# Altium project EEE3061WDesignProject_ControllerBoardV2.PrjPcb
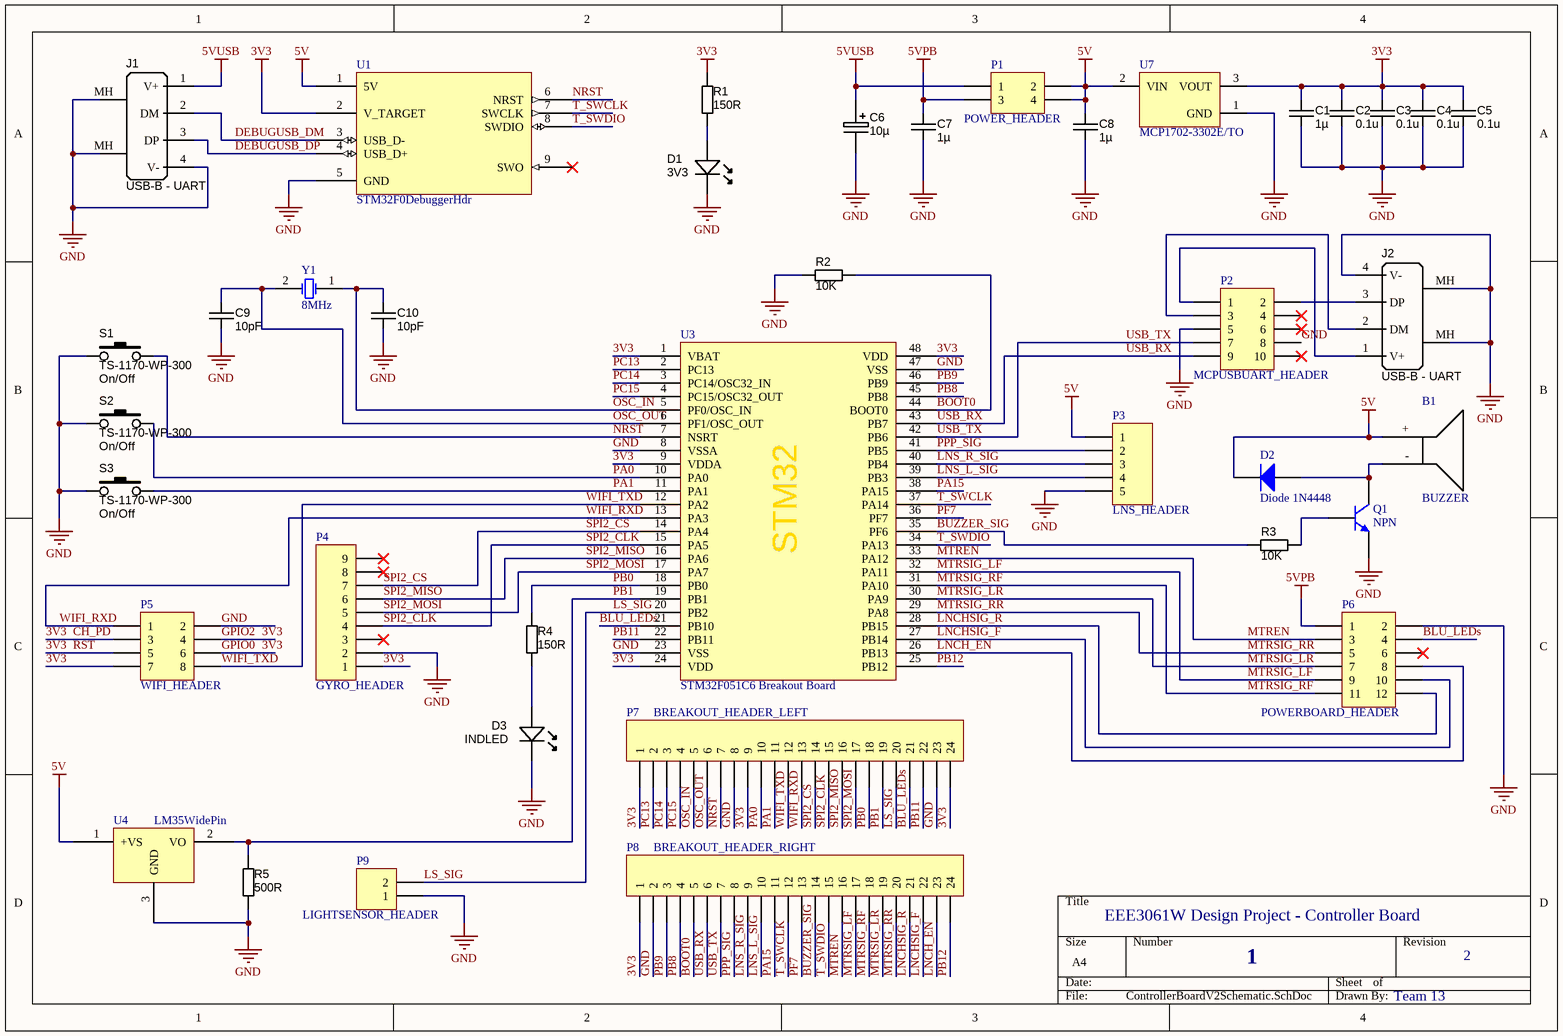
[diagram p0: ControllerBoardV2Schematic.SchDoc]
1 sheet, 39 parts. Net scope: global (net labels, ports and power ports of the same name join across sheets).
Board file: ControllerBoardV2PCB.PcbDoc

## Sheet ControllerBoardV2Schematic.SchDoc: EEE3061W Design Project - Controller Board
size A4; DrawnBy: Team 13; DocumentNumber: 1; Revision: 2; DocumentName: ControllerBoardSchematic

### Parts
B1  BUZZER  [HCM1206UX-G]
C1  value 1µ  [CAPC3216X180N]  (hidden comment: approved sub OK)
C2  value 0.1u  [CAPC2012X135N]  (hidden comment: approved sub OK)
C3  value 0.1u  [CAPC2012X135N]  (hidden comment: approved sub OK)
C4  value 0.1u  [CAPC2012X135N]  (hidden comment: approved sub OK)
C5  value 0.1u  [CAPC2012X135N]  (hidden comment: approved sub OK)
C6  10µ  [CAPR5-4X5]
C7  value 1µ  [CAPC3216X180N]  (hidden comment: approved sub OK)
C8  value 1µ  [CAPC3216X180N]  (hidden comment: approved sub OK)
C9  value 10pF  [CAPC2012X135N]  (hidden comment: approved sub OK)
C10  value 10pF  [CAPC2012X135N]  (hidden comment: approved sub OK)
D1  Color: 3V3  [LED-0805-K]  (hidden comment: 3V3LED)
D2  Diode 1N4448  [DO-35]
D3  INDLED  [LED-0805-K]
J1  USB-B - UART  [USB_TypeB_Tyco]
J2  USB-B - UART  [USB_TypeB_Tyco]
P1  POWER_HEADER  [HDR2X2]
P2  MCPUSBUART_HEADER  [HDR2X5]
P3  LNS_HEADER  [HDR1X5]
P4  GYRO_HEADER  [HDR1X9]
P5  WIFI_HEADER  [HDR2X4]
P6  POWERBOARD_HEADER  [HDR2X6]
P7  BREAKOUT_HEADER_LEFT  [HDR1X24]
P8  BREAKOUT_HEADER_RIGHT  [HDR1X24]
P9  LIGHTSENSOR_HEADER  [HDR1X2]
Q1  NPN  [TO-226-AA]
R1  value 150R  [RESC2012X70N]  (hidden comment: Thick Film)
R2  value 10K  [RESC2012X70N]  (hidden comment: Thick Film)
R3  value 10K  [RESC2012X70N]  (hidden comment: Thick Film)
R4  value 150R  [RESC2012X70N]  (hidden comment: Thick Film)
R5  value 500R  [RESC2012X70N]  (hidden comment: Thick Film)
S1  Manufacturer Part Number 1: TS-1170-WP-300  Function: On/Off  [TACT-SWITCH-TS1170]  (hidden comment: SW_THT_PB_7.0mm)
S2  Manufacturer Part Number 1: TS-1170-WP-300  Function: On/Off  [TACT-SWITCH-TS1170]  (hidden comment: SW_THT_PB_7.0mm)
S3  Manufacturer Part Number 1: TS-1170-WP-300  Function: On/Off  [TACT-SWITCH-TS1170]  (hidden comment: SW_THT_PB_7.0mm)
U1  STM32F0DebuggerHdr  [STM32F051C6_DbgrHdr]
U3  STM32F051C6 Breakout Board  [STM32F051C6BreakoutBoard]
U4  LM35WidePin  [TO-92Wide]
U7  MCP1702-3302E/TO  [TO-92-TO3]
Y1  8MHz  [8MHZOSC]

### Nets
3V3: C1.1 C2.1 C3.1 C4.1 C5.1 P4.1 P5.3 P5.4 P5.5 P5.6 P5.7 P7.1 P7.9 P7.24 P8.1 R1.1 U1.2(V_TARGET) U3.1(VBAT) U3.9(VDDA) U3.24(VDD) U3.48(VDD) U7.3(VOUT)  [also labelled CH_PD, GPIO0, GPIO2, RST]
5V: B1.+ C8.1 D2.2(K) P1.2 P1.4 P3.1 U1.1(5V) U4.1(+VS) U7.2(VIN)
5VPB: C7.1 P1.3 P6.1
5VUSB: C6.1 J1.1(V+) P1.1
GND: C1.2 C2.2 C3.2 C4.2 C5.2 C6.2 C7.2 C8.2 C9.2 C10.2 D1.K D3.K J1.4(V-) J1.MH(Shell) J2.4(V-) J2.MH(Shell) P2.5 P2.8 P3.5 P4.2 P5.2 P6.2 P7.8 P7.23 P8.2 P9.1 Q1.3(E) R2.1 R5.2 S1.1 S2.1 S3.1 U1.5(GND) U3.8(VSSA) U3.23(VSS) U3.47(VSS) U4.3(GND) U7.1(GND)
BLU_LEDs: P6.4 P7.21 U3.21(PB10)
BOOT0: P8.5 R2.2 U3.44(BOOT0)
BUZZER_SIG: P8.14 R3.1 U3.35(PF6)
DEBUGUSB_DM: J1.2(DM) U1.3(USB_D-)
DEBUGUSB_DP: J1.3(DP) U1.4(USB_D+)
LNCH_EN: P6.8 P8.23 U3.26(PB13)
LNCHSIG_F: P6.10 P8.22 U3.27(PB14)
LNCHSIG_R: P6.12 P8.21 U3.28(PB15)
LNS_L_SIG: P3.4 P8.10 U3.39(PB3)
LNS_R_SIG: P3.3 P8.9 U3.40(PB4)
LS_SIG: P7.20 P9.2 U3.20(PB2)
MTREN: P6.3 P8.16 U3.33(PA12)
MTRSIG_LF: P6.9 P8.17 U3.32(PA11)
MTRSIG_LR: P6.7 P8.19 U3.30(PA9)
MTRSIG_RF: P6.11 P8.18 U3.31(PA10)
MTRSIG_RR: P6.5 P8.20 U3.29(PA8)
NRST: P7.7 S1.2 U1.6(NRST) U3.7(NSRT)
OSC_IN: C10.1 P7.5 U3.5(PF0/OSC_IN) Y1.1(OSC1)
OSC_OUT: C9.1 P7.6 U3.6(PF1/OSC_OUT) Y1.2(OSC2)
PA0: P7.10 S2.2 U3.10(PA0)
PA1: P7.11 S3.2 U3.11(PA1)
PA15: P8.11 U3.38(PA15)
PB0: P7.18 R4.1 U3.18(PB0)
PB1: P7.19 R5.1 U3.19(PB1) U4.2(VO)
PB8: P8.4 U3.45(PB8)
PB9: P8.3 U3.46(PB9)
PB11: P7.22 U3.22(PB11)
PB12: P8.24 U3.25(PB12)
PC13: P7.2 U3.2(PC13)
PC14: P7.3 U3.3(PC14/OSC32_IN)
PC15: P7.4 U3.4(PC15/OSC32_OUT)
PF7: P8.13 U3.36(PF7)
PPP_SIG: P3.2 P8.8 U3.41(PB5)
SPI2_CLK: P4.4 P7.15 U3.15(PA5)
SPI2_CS: P4.7 P7.14 U3.14(PA4)
SPI2_MISO: P4.6 P7.16 U3.16(PA6)
SPI2_MOSI: P4.5 P7.17 U3.17(PA7)
T_SWCLK: P8.12 U1.7(SWCLK) U3.37(PA14)
T_SWDIO: P8.15 U1.8(SWDIO) U3.34(PA13)
USB_RX: P2.9 P8.6 U3.43(PB7)
USB_TX: P2.7 P8.7 U3.42(PB6)
WIFI_RXD: P5.1 P7.13 U3.13(PA3)
WIFI_TXD: P5.8 P7.12 U3.12(PA2)
NetB1_-: B1.- D2.1(A) Q1.1(C)
NetD1_A: D1.A R1.2
NetD3_A: D3.A R4.2
NetJ2_1: J2.1(V+) P2.1
NetJ2_2: J2.2(DM) P2.3
NetJ2_3: J2.3(DP) P2.2
NetQ1_2: Q1.2(B) R3.2

Not connected (* = marked no-connect by the designer): P2 4* 6* 10*; P4 3* 8* 9*; P6 6*; U1 9(SWO)*

### Notes on the sheet
- (in symbol STM32F051C6Brk) STM32

### Library data of the parts
B1 = HCM1206UX-G: 2.3KHz Internally Driven Buzzer; pin to pad: +>1 ->0
C1 C7 C8 = CAPC_10u_1206_16V: Capacitor SMD Cer 10uF 10% 16V X7R 1206; Manufacturer 1: Kemet; Manufacturer Part Number 1: C1206C106K4RACTU; Ratings: 16V; X7R; Material: ceramic; SCDType: spec; Package / Case: 1206 (3216 metric); Tolerance: ±10%; Supplier 1: Digi-Key; Supplier Part Number 1: 399-3525-1-ND
C2-C5 C9 C10 = CAPC_1n8_50V_0805: Capacitor SMD Cer 1.8nF 10% 50V X7R 0805; Manufacturer 1: AVX Corporation; Manufacturer Part Number 1: 08055C182KAT2A; Ratings: 50V; X7R; SCDType: source*; Tolerance: ±10%; Operating Temperature: -55°C ~ 125°C; Package / Case: 0805 (2012 metric); Supplier 1: Digi-Key; Supplier Part Number 1: 478-1374-1-ND
C6 = CAPE_220u_16V_THD_2.5mmLS: Capacitor THT Alum Elec 220uF 20% 16V 2.5mmLS; Manufacturer 1: Nichicon; Manufacturer Part Number 1: UVR1C221MED; Ratings: 16V; 80°C; Material: Al; SCDType: undef; Package / Case: radial 6.3D x 11.0H x 2.5mm pitch; Tolerance: ±20%; Supplier 1: Digi-Key; Supplier Part Number 1: 493-1041-ND; Value: 10µ
D1 = LED_SMD_Green_0805_6mcd: LED, 0805 SMD, Green; Manufacturer 1: LITE-ON; Manufacturer Part Number 1: LTST-C171GKT; Material: GaP; Ratings: 6 mcd; 569 nm; Value: 3V3; SCDType: source; Package / Case: 0805; Supplier 1: Digi-Key; Supplier Part Number 1: 160-1423-1-ND
D2 = Diode 1N4448: High Conductance Fast Diode; Published: 8-Jun-2000; LatestRevisionDate: 17-Jul-2002; LatestRevisionNote: Re-released for DXP Platform.; DatasheetVersion: 1997; PackageReference: DO-35; Publisher: Altium Limited; PackageDescription: Diode, Axial; Body 3.8 x 1.9 mm (LxDia. max), Lead Dia. 0.53 mm (max); Code_JEDEC: DO-204-AH; ComponentLink1Description: Manufacturer Link; ComponentLink1URL: http://www.fairchildsemi.com/; ComponentLink2Description: Datasheet; ComponentLink2URL: http://www.fairchildsemi.com/ds/1N%2F1N4448.pdf
D3 = LED_SMD_Green_0805_6mcd: LED, 0805 SMD, Green; Manufacturer 1: LITE-ON; Manufacturer Part Number 1: LTST-C171GKT; Material: GaP; Ratings: 6 mcd; 569 nm; SCDType: source; Package / Case: 0805; Supplier 1: Digi-Key; Supplier Part Number 1: 160-1423-1-ND; Value: INDLED; Color: INDLED
J1 J2 = USB_TypeB: Connector THT Type B USB connector; Manufacturer Part Number 1: 292304-1; Manufacturer 1: TE Connectivity; Specifications: USB 2.0; SCDType: undef; Package / Case: R/A Type B; Supplier 1: Digi-Key; Connector Type: USB - B; Supplier Part Number 1: A31725-ND
P1 = Header 2X2: Header, 2-Pin, Dual row; LatestRevisionDate: 17-Jul-2002; LatestRevisionNote: Re-released for DXP Platform.; Publisher: Altium Limited
P2 = Header 5X2: Header, 5-Pin, Dual row; LatestRevisionDate: 17-Jul-2002; LatestRevisionNote: Re-released for DXP Platform.; Publisher: Altium Limited
P3 = Header 5: Header, 5-Pin; LatestRevisionDate: 17-Jul-2002; LatestRevisionNote: Re-released for DXP Platform.; Publisher: Altium Limited
P4 = Header 9: Header, 9-Pin; LatestRevisionDate: 17-Jul-2002; LatestRevisionNote: Re-released for DXP Platform.; Publisher: Altium Limited
P5 = Header 4X2: Header, 4-Pin, Dual row; LatestRevisionDate: 17-Jul-2002; LatestRevisionNote: Re-released for DXP Platform.; Publisher: Altium Limited
P6 = Header 6X2: Header, 6-Pin, Dual row; LatestRevisionDate: 17-Jul-2002; LatestRevisionNote: Re-released for DXP Platform.; Publisher: Altium Limited
P7 P8 = Header 24: Header, 24-Pin; LatestRevisionDate: 17-Jul-2002; LatestRevisionNote: Re-released for DXP Platform.; Publisher: Altium Limited
P9 = Header 2: Header, 2-Pin; LatestRevisionDate: 17-Jul-2002; LatestRevisionNote: Re-released for DXP Platform.; Publisher: Altium Limited
Q1 = NPN: NPN Bipolar Transistor; Published: 8-Jun-2000; LatestRevisionDate: 17-Jul-2002; LatestRevisionNote: Re-released for DXP Platform.; PackageReference: TO-226-AA; Publisher: Altium Limited; PackageDescription: TO, Flat Index; 3 In-Line, Axial Leads; Body Dia. 4.8mm; Leads 0.55 x 0.51 mm (max); Code_JEDEC: TO-226-AA
R1-R5 = RES_150R_0805_5%: Resistor SMD chip 150 Ohm 0.125W 5% 0805; Manufacturer 1: Vishay/Dale; Manufacturer Part Number 1: CRCW0805150RJNEA; Ratings: 1/8W; SCDType: spec; Tolerance: ±5%; Package / Case: 0805 (2012 metric); Supplier 1: Digi-Key; Supplier Part Number 1: 541-150ACT-ND
S1-S3 = SW_THT_PB_7.0mm: Switch, tact, 7.0mm stem; Manufacturer 1: Bond-Tact; SCDType: source*; Package / Case: 6.5x6.5mm; 7.0mm stem; Material: Brass/Nylon/Ag plating
U3 = STM32F051C6Brk
U4 = LM35Big
U7 = CMP-0136-00017-1: 250 mA Low Quiescent Current LDO Regulator, 3-Pin TO-92, Extended TemperatureBAG; PackageVersion: revBB, Aug-2009; DatasheetVersion: revD, Jun-2009; PackageDescription: 3-Lead Plastic Transistor Outline (TO) [TO-92]; PackageReference: TO-92-TO3
Y1 = XTAL: Crystal Oscillator; Published: 8-Jun-2000; LatestRevisionDate: 17-Jul-2002; LatestRevisionNote: Re-released for DXP Platform.; PackageReference: R38; Publisher: Altium Limited; PackageDescription: Crystal, Thru-Hole; 2 Leads; Body 3.1 x 8.2 mm (Dia.xH)